# EAGLE design BMSv6_BatLength (EAGLE 7.6.0)

## Sheet 1 of 2
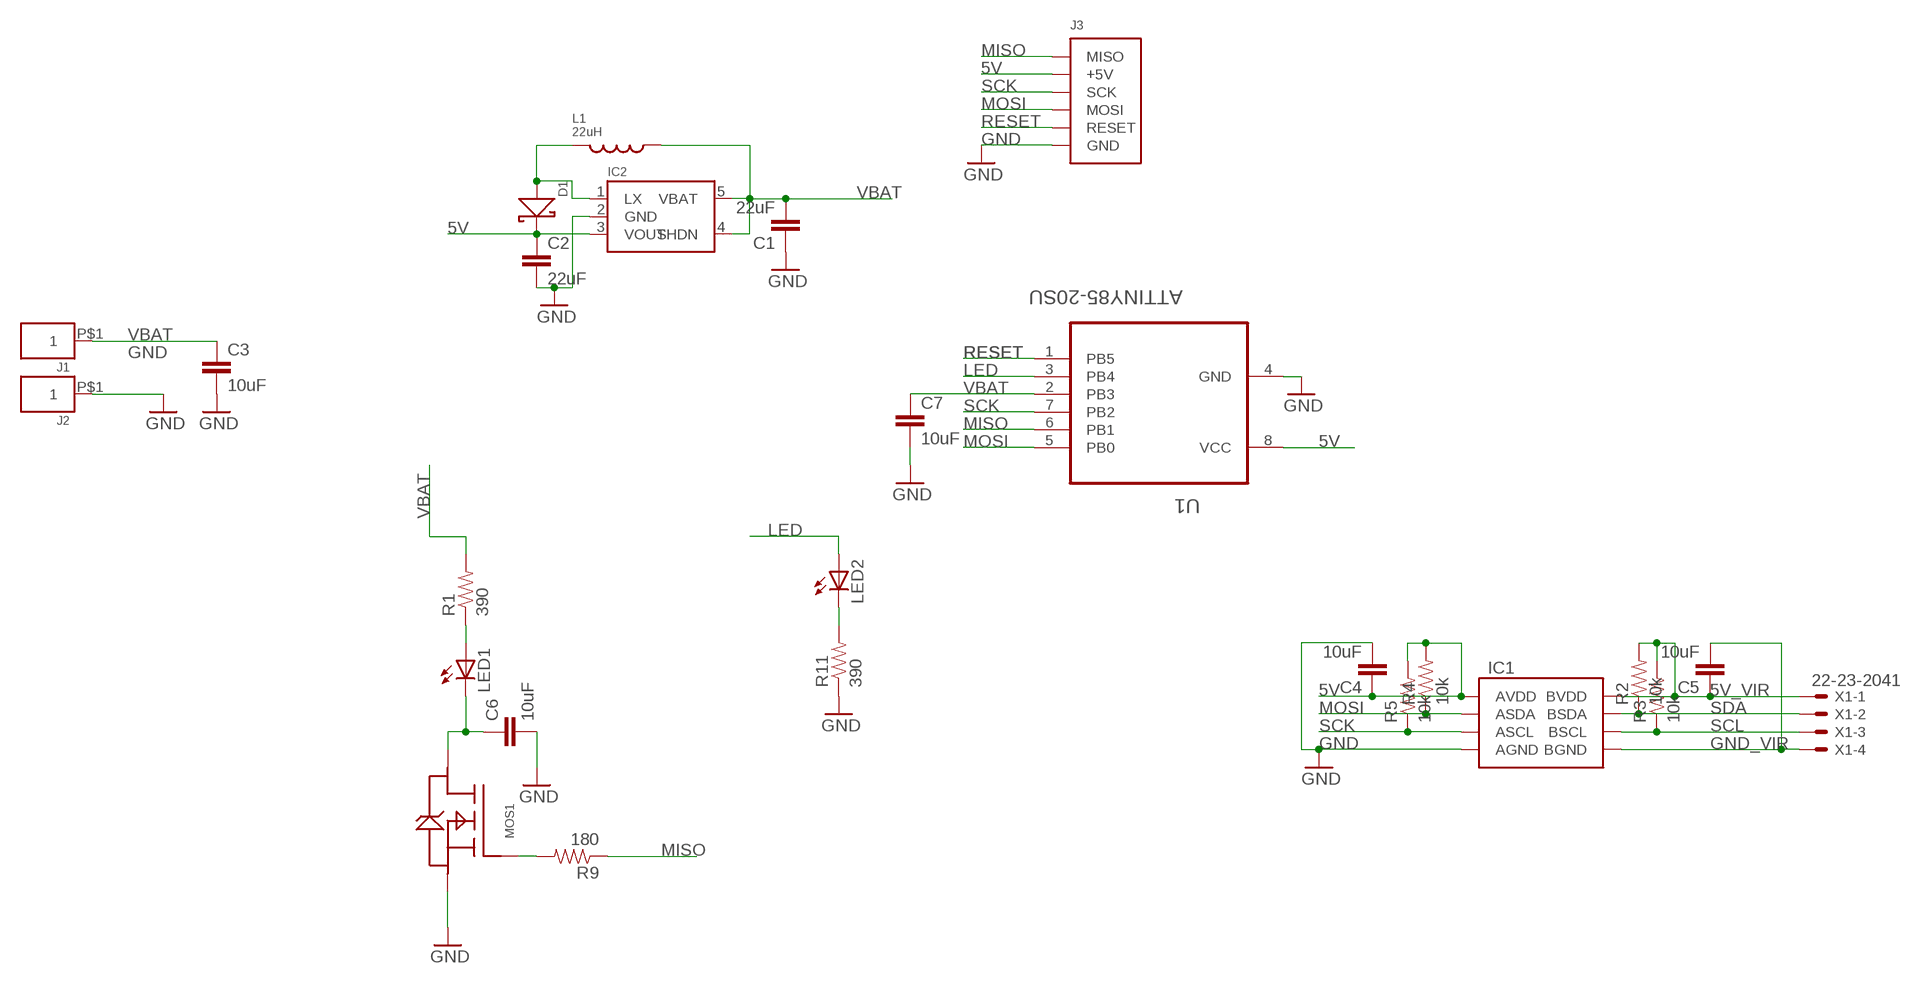
[diagram p0: schematic, sheet 1]

### Parts
C1  22uF  10UF10V10%(0805)  [0805-CAP]
C2  22uF  10UF10V10%(0805)  [0805-CAP]
C3  10uF  10UF10V10%(0805)  [0805-CAP]
C4  10uF  10UF10V10%(0805)  [0805-CAP]
C5  10uF  10UF10V10%(0805)  [0805-CAP]
C6  10uF  10UF10V10%(0805)  [0805-CAP]
C7  10uF  10UF10V10%(0805)  [0805-CAP]
D1  DIODE_SCHOTTKYSOD-123  [SOD-123]
IC1  SI8600_DUALCHANNELISO  [SOIC-8]
IC2  SP6641  [SOT-23]
J1  CONNECTOR_1PIN  [SMD_PAD_.15X.25]
J2  CONNECTOR_1PIN  [SMD_PAD_.15X.25]
J3  ISPHEADER  [2X3PIN_.1']
L1  22uH  CHIP_IND1  [6X6MM_IND]
LED1  LEDCHIPLED_0805  [CHIPLED_0805]
LED2  LEDCHIPLED_0805  [CHIPLED_0805]
MOS1  MOS_N_LOGIC_PSMN7R0  [LFPAK]
R1  390  0.3OHM-1/8W-1%(0805)  [0805]
R2  10k  0.3OHM-1/8W-1%(0805)  [0805]
R3  10k  0.3OHM-1/8W-1%(0805)  [0805]
R4  10k  0.3OHM-1/8W-1%(0805)  [0805]
R5  10k  0.3OHM-1/8W-1%(0805)  [0805]
R9  180  0.3OHM-1/8W-1%(0805)  [0805]
R11  390  0.3OHM-1/8W-1%(0805)  [0805]
U1  ATTINY85-20SU  [SOIC127P798X216-8N]
X1  22-23-2041  [22-23-2041]

### Nets
5V: C2.1 C4.1 D1.CATHODE IC1.P$1(AVDD) IC2.3(VOUT) J3.P$2(+5V) R4.2 R5.2 U1.8(VCC)
5V_VIR: C5.1 IC1.P$8(BVDD) R2.2 R3.2 X1.1
D: C6.1 LED1.C MOS1.P$5(DRAIN)
GND: C1.1 C2.2 C3.2 C4.2 C6.2 C7.2 IC1.P$4(AGND) IC2.2(GND) J2.P$1 J3.P$6(GND) MOS1.P$1(SOURCE) MOS1.P$2(SOURCE) MOS1.P$3(SOURCE) R11.1 U1.4(GND)
GND_VIR: C5.2 IC1.P$5(BGND) X1.4
LED: LED2.A U1.3(PB4)
MISO: J3.P$1(MISO) R9.1 U1.6(PB1)
MOSI: IC1.P$2(ASDA) J3.P$4(MOSI) R4.1 U1.5(PB0)
N$2: MOS1.P$4(GATE) R9.2
N$3: LED1.A R1.1
N$4: LED2.C R11.2
N$29: D1.ANODE IC2.1(LX) L1.P$1
RESET: J3.P$5(RESET) U1.1(PB5)
SCK: IC1.P$3(ASCL) J3.P$3(SCK) R5.1 U1.7(PB2)
SCL: IC1.P$6(BSCL) R3.1 X1.3
SDA: IC1.P$7(BSDA) R2.1 X1.2
VBAT: C1.2 C3.1 C7.1 IC2.4(SHDN) IC2.5(VBAT) J1.P$1 L1.P$2 R1.2 U1.2(PB3)

## Sheet 2 of 2

## Library data of the parts
C1-C7 = SparkFun-Capacitors:10UF10V10%(0805): CAP-11330; PROD_ID: CAP-11330
D1 = lolomolo:DIODE_SCHOTTKY
IC1 = lolomolo:SI8600_DUALCHANNELISO
IC2 = lolomolo:SP6641
J1 J2 = lolomolo:CONNECTOR_1PIN
J3 = lolomolo:ISPHEADER
L1 = lolomolo:CHIP_IND: Chip Inductor
LED1 LED2 = adafruit:LED: LED OSRAM: - CHIPLED LG R971, LG N971, LY N971, LG Q971, LY Q971, LO R971, LY R971 LH N974, LH R974 LS Q976, LO Q976, LY Q976 LO Q996 - Hyper CHIPLED LW Q18S LB Q993, LB Q99A, LB R99A - SideLED LS A670, LO A670, LY A670, LG A670, LP A670 LB A673, LV A673, LT A673, LW A673 LH A674 LY A675 LS A676, LA A676, LO A676, LY A676, LW A676 LS A679, LY A679, LG A679 - Hyper Micro SIDELED® LS Y876, LA Y876, LO Y876, LY Y876 LT Y87S - SmartLED LW L88C, LW L88S LB L89C, LB L89S, LG L890 LS L89K, LO L89K, LY L89K LS L896, LA L896, LO L896, LY L896 - TOPLED LS T670, LO T670, LY T670, LG T670, LP T670 LSG T670, LSP T670, LSY T670, LOP T670, LYG T670 LG T671, LOG T671, LSG T671 LB T673, LV T673, LT T673, LW T673 LH T674 LS T676, LA T676, LO T676, LY T676, LB T676, LH T676, LSB T676, LW T676 LB T67C, LV T67C, LT T67C, LS T67K, LO T67K, LY T67K, LW E67C LS E67B, LA E67B, LO E67B, LY E67B, LB E67C, LV E67C, LT E67C LW T67C LS T679, LY T679, LG T679 LS T770, LO T770, LY T770, LG T770, LP T770 LB T773, LV T773, LT T773, LW T773 LH T774 LS E675, LA E675, LY E675, LS T675 LS T776, LA T776, LO T776, LY T776, LB T776 LHGB T686 LT T68C, LB T68C - Hyper Mini TOPLED® LB M676 - Mini TOPLED Santana® LG M470 LS M47K, LO M47K, LY M47K Source: http://www.osram.convergy.de/
MOS1 = lolomolo:MOS_N_LOGIC_PSMN7R0
R1-R5 R9 R11 = SparkFun-Resistors:0.3OHM-1/8W-1%(0805): RES-11622; PROD_ID: RES-11622; VALUE: 0.3
U1 = Atmel_By_element14_Batch_1-00:ATTINY85-20SU: 8-bit Microcontroller with In-System Programmable Flash; MPN: ATTINY85-20SU; OC_FARNELL: 1455164; OC_NEWARK: 58M3797; PACKAGE: SOIC-8; SUPPLIER: Atmel
X1 = con-molex:22-23-2041: .100" (2.54mm) Center Header - 4 Pin; MF: MOLEX; MPN: 22-23-2041; OC_FARNELL: 1462920; OC_NEWARK: 38C0355

## Board
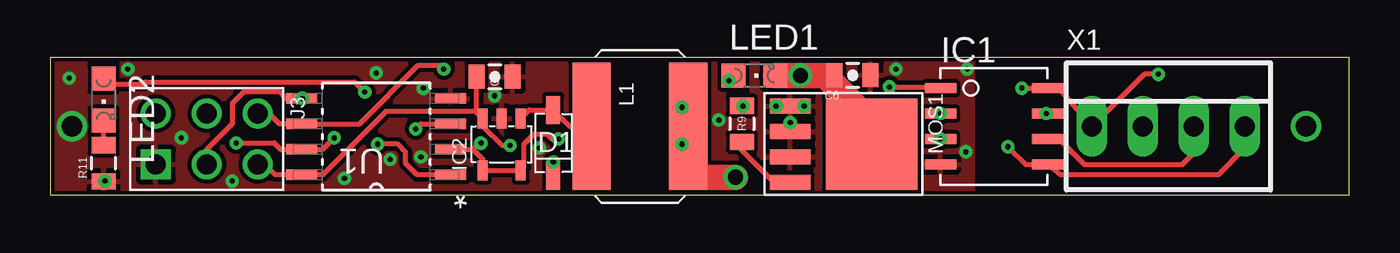
[diagram p1: board, top side]
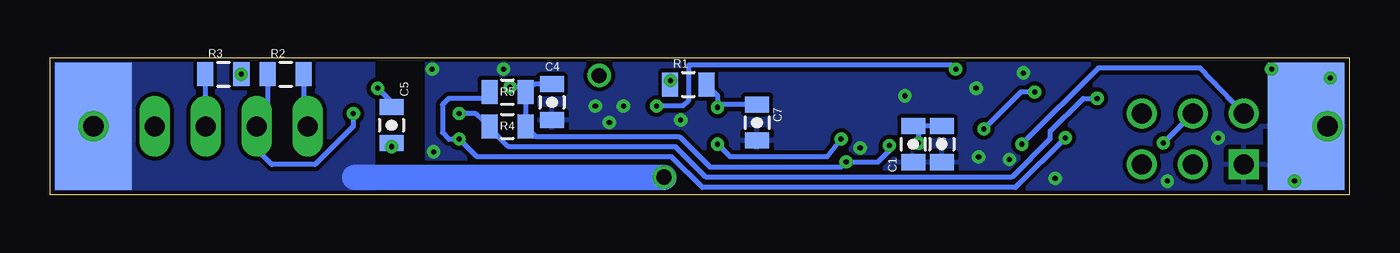
[diagram p2: board, bottom side, seen from below]

Size 64.77 x 6.86 mm. Coordinates in mm from the lower left corner, seen from the top.
Outline: 0,0 64.77,0 64.77,6.86 0,6.86 0,0
Copper layers (1*16): Top 0.035mm / dielectric 1.5mm / Bottom 0.035mm
Design rules "PCBWAY *": minimum track width 10mil, minimum drill 10mil, track to track 8mil, track to pad 8mil, pad to pad 8mil, via to via 8mil, smd to smd 8mil, copper to edge 8mil, drill to drill 8mil, minimum pad ring 10mil, minimum via ring 8mil, stop-mask expansion 4mil, vias tented up to drill 0mil, thermal gap 10mil

### Footprints (pad centres in the part's own frame; a part is rotated, then mirrored left to right if it is on the bottom)
0805-CAP = smd 0.8 x 1.2: 1 -0.9,0; 2 0.9,0
SOD-123 = smd 1.4 x 0.7: ANODE 0,0; CATHODE 3.3,0
SOIC-8 = smd 1.575 x 0.508: P$1 0,3.81; P$2 0,2.54; P$3 0,1.27; P$4 0,0; P$5 5.334,0; P$6 5.334,1.27; P$7 5.334,2.54; P$8 5.334,3.81
SOT-23 = smd 1 x 0.5: 1 1.29,-0.92; 2 1.29,0.03; 3 1.29,0.98; 4 -1.31,0.98; 5 -1.31,-0.92
SMD_PAD_.15X.25 = smd 3.81 x 6.35: P$1 0,0
2X3PIN_.1' = drill 0.991: P$1 -1.27,1.27; P$2 1.27,1.27; P$3 -1.27,-1.27; P$4 1.27,-1.27; P$5 -1.27,-3.81 | drill 0.991 square: P$6 1.27,-3.81
6X6MM_IND = smd 1.905 x 6.35: P$1 -2.413,0; P$2 2.413,0
CHIPLED_0805 = smd 1.2 x 1.2: A 0,-1.05; C 0,1.05
LFPAK = smd 0.762 x 2.032: P$1 0,0; P$2 1.27,0; P$3 2.54,0; P$4 3.81,0 | smd 4.572 x 4.572: P$5 1.905,4.064
0805 = smd 0.8 x 1.2: 1 -0.9,0; 2 0.9,0
SOIC127P798X216-8N = smd 1.549 x 0.533: 1 -3.708,1.905; 2 -3.708,0.635; 3 -3.708,-0.635; 4 -3.708,-1.905; 5 3.708,-1.905; 6 3.708,-0.635; 7 3.708,0.635; 8 3.708,1.905
22-23-2041 = drill 1 long: 1 -3.81,0; 2 -1.27,0; 3 1.27,0; 4 3.81,0

### Placement (x,y rotation side)
C1  21.74,2.54 90 bottom
C2  22.16,5.91 0 top
C3  20.32,2.54 270 bottom
C4  39.75,4.64 270 bottom
C5  47.75,3.49 270 bottom
C6  40.01,5.98 0 top
C7  29.53,3.62 270 bottom
D1  25.08,4.25 270 top
IC1  44.39,1.52 0 top
IC2  22.54,2.54 90 top
J1  62.61,3.43 0 bottom
J2  2.16,3.43 0 bottom
J3  9.08,2.79 270 top
L1  29.4,3.43 0 top
LED1  35.12,5.97 270 top
LED2  2.67,4.76 180 top
MOS1  36.89,4.45 270 top
R1  32.96,5.52 0 bottom
R2  53.02,6.03 0 bottom
R3  56.13,6.03 0 bottom
R4  41.97,3.43 0 bottom
R5  41.97,5.14 0 bottom
R9  34.48,3.56 270 top
R11  2.67,1.59 90 top
U1  16.26,2.92 180 top
X1  55.75,3.43 0 top

### Tracks (layer width: path | path; a pad name or v marks a point on that pad's centre or on a via)
5V  (via drill 0.25)
  Top 0.254: J3.P$2 10.73,1.52 11.24,1.02 U1.8 13.59,1.02 16.76,4.19 21.39,4.19 21.26,4.13 | IC2.3 21.33,4.06 | v25.08,1.65 D1.CATHODE | v41.85,5.4 44.45,5.4 IC1.P$1 | IC2.3 21.59,3.8 21.59,3.43 22.54,2.48 v22.92,2.48 22.8,2.48 | IC2.3 21.26,4.13 | 21.26,4.13 C2.1
  Bottom 0.254: R5.2 R4.2 40.57,2.92 33.4,2.92 31.88,1.4 25.34,1.4 v25.08,1.65 23.5,1.65 22.92,2.22 v22.92,2.48 | R5.2 41.07,5.39 v41.85,5.4 | C4.1 40.62,5.54 R5.2
5V_VIR  (via drill 0.25)
  Top 0.254: v48.45,5.33 IC1.P$8 50.29,5.33 X1.1 54.55,6.03 v55.24,6.03
  Bottom 0.254: 51.89,3.43 X1.1 52.12,3.61 R2.2 | C5.1 47.75,4.64 v48.45,5.33 | R3.2 55.23,5.92 v55.24,6.03
D  (via drill 0.76)
  Top 0.254: C6.1 39.1,5.7 38.99,5.59
  Top 1.27: MOS1.P$5 40.83,2.67 40.83,3.75 38.99,5.59 38.61,5.97 v37.4,5.97 LED1.C
GND  (via drill 0.25, 1.02)
  Bottom 0.254: 4,6.22 3.87,6.22 v3.87,6.29
  Bottom 0.406: v3.87,6.29 0.95,6.29 v0.95,5.84 | 4,6.22 1.08,6.22
  other vias: 9.08,0.7 36.89,3.62 36.2,4.45 37.59,4.45 45.72,6.29 18.48,1.91 16.95,1.78 14.67,0.83 18.61,5.33 22.16,4.95 45.66,2.16 2.73,0.7 6.54,2.86 1.08,3.43 42.16,6.29 16.26,6.1 24.38,2.35 33.34,3.75
  pour Bottom: 0,6.86 45.97,6.86 45.97,0 0,0
  pour Top: 0,6.86 45.97,6.86 45.97,0 0,0
GND_VIR  (via drill 0.25)
  Top 0.254: X1.4 59.56,2.35 58.23,1.02 50.35,1.02 IC1.P$5 48.64,1.52 v47.75,2.41
  Bottom 0.254: C5.2 v47.75,2.41
LED  (via drill 0.25)
  Top 0.254: 2.76,5.81 LED2.A 2.96,5.52 4.64,5.52 4.76,5.65 15.18,5.65 v15.68,5.14 | v18.22,3.3 18.48,3.56 U1.3
  Bottom 0.254: v15.68,5.14 16.38,5.14 v18.22,3.3
MISO  (via drill 0.25)
  Top 0.254: J3.P$1 10.92,4.06 11.43,3.56 U1.6 15.43,3.56 18.35,6.48 19.43,6.48 v19.62,6.29 | v34.54,4.45 34.62,4.45 R9.1
  Bottom 0.254: v34.54,4.45 33.21,4.45 32.96,4.7 32.96,6.48 19.81,6.48 v19.62,6.29
MOSI  (via drill 0.25)
  Top 0.254: 12.7,4.7 v12.57,4.83 U1.5 11.75,4.83 11.43,5.14 9.65,5.14 9.08,4.57 9.08,3.56 7.81,2.29 J3.P$4
  Bottom 0.254: IC1.P$2 43.57,4.06 R4.1 42.87,3.38 41.91,2.41 33.59,2.41 32.07,0.89 16.83,0.89 14.92,2.79 14.92,3.17 13.27,4.83 v12.57,4.83
  other vias: 44.39,4.06
N$2
  Top 0.254: MOS1.P$4 36.83,0.7 36.01,0.7 34.48,2.22 R9.2
N$3  (via drill 0.25)
  Top 0.254: v33.85,5.71 33.97,5.97 LED1.A
  Bottom 0.254: R1.1 v33.85,5.71
N$4
  Top 0.254: R11.2 LED2.C
N$29
  Top 0.254: IC2.1 23.89,4.25 D1.ANODE 25.91,3.43 L1.P$1
RESET  (via drill 0.25)
  Top 0.254: U1.1 18.29,1.02 17.72,1.59 17.72,2.16 17.34,2.54 v16.32,2.54
  Bottom 0.254: J3.P$5 7.43,6.35 12.51,6.35 v16.32,2.54
SCK  (via drill 0.25)
  Top 0.254: v9.27,2.6 11.18,2.6 11.49,2.29 U1.7 13.59,2.29 v14.16,2.86
  Bottom 0.254: J3.P$3 v9.27,2.6 | v14.16,2.86 16.64,0.38 32.26,0.38 33.78,1.91 43.5,1.91 IC1.P$3 44.9,2.79 45.21,3.11 45.21,4.51 44.9,4.83 43.13,4.83 R5.1
  other vias: 44.39,2.79
SCL
  Top 0.254: IC1.P$6 50.29,2.79 51.56,1.52 56.45,1.52 57.02,2.1 X1.3
  Bottom 0.254: R3.1 57.03,3.44 X1.3
SDA  (via drill 0.25)
  Top 0.254: IC1.P$7 v49.66,4.06
  Bottom 0.254: v49.66,4.06 49.66,3.43 51.56,1.52 53.72,1.52 54.48,2.29 X1.2 53.92,3.99 R2.1
VBAT  (via drill 0.25, 0.76, 1.02)
  Top 0.254: 23.44,1.21 IC2.5 | U1.2 21.08,2.29 | 31.94,1.4 32.07,1.4 L1.P$2 | 21.08,2.29 21.56,1.81 IC2.4 IC2.5 | v31.5,2.54 31.3,2.92 L1.P$2 | v31.5,4.38 31.56,3.68 L1.P$2 | 21.08,2.29 21.47,2.68 v21.47,2.59 | IC2.5 23.62,1.39 23.62,2.54 24.13,3.05 24.77,3.05 25.02,2.79 v25.34,2.79
  Top 1.27: 31.94,1.4 32.45,0.89 v34.16,0.89
  Bottom 0.254: v25.34,2.79 25.59,2.48 26.04,1.91 30.86,1.91 v31.5,2.54 | C3.1 C1.2 21.47,3.17 v21.47,2.59 | 31.5,4.25 v31.5,4.38 | C7.1 31.36,4.52 v31.5,4.38 | R1.2 31.5,4.96 v31.5,4.38
  Bottom 1.27: J1.P$1 62.61,0.89 | v34.16,0.89 49.59,0.89
  other vias: 62.61,3.43
  pour Bottom (no thermals): 48.7,6.86 48.7,0 64.77,0 64.77,6.86